# EAGLE schematic converting_to_smd (EAGLE 9.1.2)
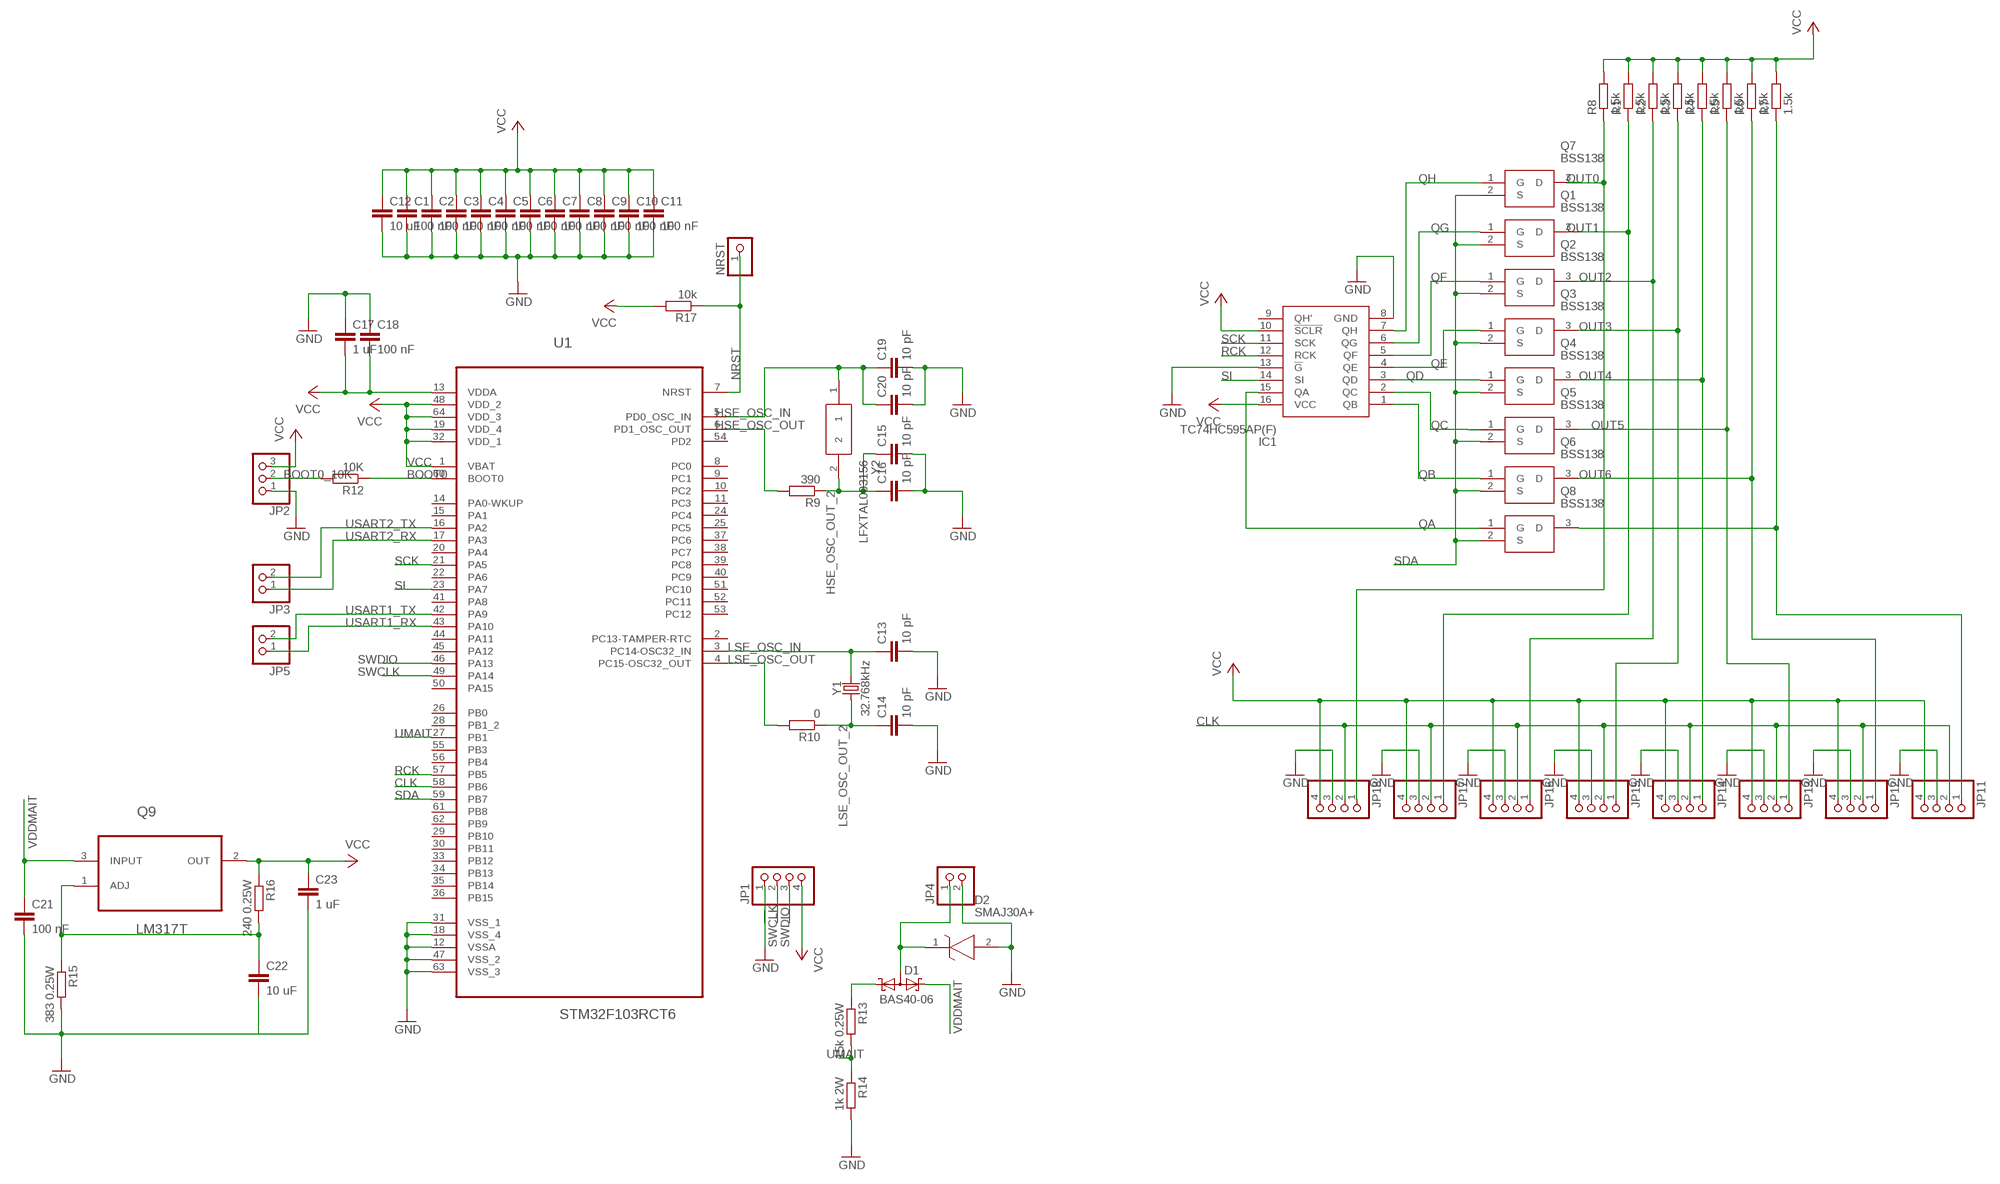
[diagram p0: schematic, sheet 1]

## Parts
C1  100 nF  C-EUC0603  [C0603]
C2  100 nF  C-EUC0603  [C0603]
C3  100 nF  C-EUC0603  [C0603]
C4  100 nF  C-EUC0603  [C0603]
C5  100 nF  C-EUC0603  [C0603]
C6  100 nF  C-EUC0603  [C0603]
C7  100 nF  C-EUC0603  [C0603]
C8  100 nF  C-EUC0603  [C0603]
C9  100 nF  C-EUC0603  [C0603]
C10  100 nF  C-EUC0603  [C0603]
C11  100 nF  C-EUC0603  [C0603]
C12  10 uF  C-EUC0603  [C0603]
C13  10 pF  C-EUC0805  [C0805]
C14  10 pF  C-EUC0805  [C0805]
C15  10 pF  C-EUC0805  [C0805]
C16  10 pF  C-EUC0805  [C0805]
C17  1 uF  C-EUC0603  [C0603]
C18  100 nF  C-EUC0603  [C0603]
C19  10 pF  C-EUC0805  [C0805]
C20  10 pF  C-EUC0805  [C0805]
C21  100 nF  C-EUC0603  [C0603]
C22  10 uF  C-EUC0603  [C0603]
C23  1 uF  C-EUC0603  [C0603]
D1  BAS40-06  [SOT23]
D2  SMAJ30A+  [DIOM5026X262N]
IC1  TC74HC595AP(F)  [DIP762W60P254L1925H445Q16N]
JP1  PINHD-1X4  [1X04]
JP2  PINHD-1X3  [1X03]
JP3  PINHD-1X2  [1X02]
JP4  PINHD-1X2  [1X02]
JP5  PINHD-1X2  [1X02]
JP11  PINHD-1X4  [1X04]
JP12  PINHD-1X4  [1X04]
JP13  PINHD-1X4  [1X04]
JP14  PINHD-1X4  [1X04]
JP15  PINHD-1X4  [1X04]
JP16  PINHD-1X4  [1X04]
JP17  PINHD-1X4  [1X04]
JP18  PINHD-1X4  [1X04]
NRST  PINHD-1X1  [1X01]
Q1  BSS138  [SOT95P240X120-3N]
Q2  BSS138  [SOT95P240X120-3N]
Q3  BSS138  [SOT95P240X120-3N]
Q4  BSS138  [SOT95P240X120-3N]
Q5  BSS138  [SOT95P240X120-3N]
Q6  BSS138  [SOT95P240X120-3N]
Q7  BSS138  [SOT95P240X120-3N]
Q8  BSS138  [SOT95P240X120-3N]
Q9  LM317T  [TO254P450X1020X2000-3P]
R1  1.5k  R-EU_0207/15  [0207/15]
R2  1.5k  R-EU_0207/15  [0207/15]
R3  1.5k  R-EU_0207/15  [0207/15]
R4  1.5k  R-EU_0207/15  [0207/15]
R5  1.5k  R-EU_0207/15  [0207/15]
R6  1.5k  R-EU_0207/15  [0207/15]
R7  1.5k  R-EU_0207/15  [0207/15]
R8  1.5k  R-EU_0207/15  [0207/15]
R9  390  R-EU_0207/15  [0207/15]
R10  0  R-EU_0207/15  [0207/15]
R12  10K  R-EU_0207/15  [0207/15]
R13  15k 0.25W  R-EU_0207/15  [0207/15]
R14  1k 2W  R-EU_0207/15  [0207/15]
R15  383 0.25W  R-EU_0207/15  [0207/15]
R16  240 0.25W  R-EU_0207/15  [0207/15]
R17  10k  R-EU_0207/15  [0207/15]
U1  STM32F103RCT6  [QFP50P1200X1200X160-64N]
Y1  32.768kHz  CRYSTAL-32.768KHZPTH-2X6  [CRYSTAL-PTH-2X6-CYL]
Y2  LFXTAL003156  [IQD-HC-49-4H]

## Nets
BOOT0: R12.1 U1.60(BOOT0)
BOOT0_10K: JP2.2 R12.2
CLK: JP11.2 JP12.2 JP13.2 JP14.2 JP15.2 JP16.2 JP17.2 JP18.2 U1.58(PB6)
GND: C1.2 C2.2 C3.2 C4.2 C5.2 C6.2 C7.2 C8.2 C9.2 C10.2 C11.2 C12.2 C13.2 C14.2 C15.2 C16.2 C17.1 C18.1 C19.2 C20.2 C21.2 C22.2 C23.2 D2.2(A) IC1.8(GND) IC1.13(!G) JP1.1 JP2.1 JP4.2 JP11.3 JP12.3 JP13.3 JP14.3 JP15.3 JP16.3 JP17.3 JP18.3 R14.2 R15.2 U1.12(VSSA) U1.18(VSS_4) U1.31(VSS_1) U1.47(VSS_2) U1.63(VSS_3)
HSE_OSC_IN: C19.1 C20.1 U1.5(PD0_OSC_IN) Y2.1
HSE_OSC_OUT: R9.2 U1.6(PD1_OSC_OUT)
HSE_OSC_OUT_2: C15.1 C16.1 R9.1 Y2.2
LSE_OSC_IN: C13.1 U1.3(PC14-OSC32_IN) Y1.2
LSE_OSC_OUT: R10.2 U1.4(PC15-OSC32_OUT)
LSE_OSC_OUT_2: C14.1 R10.1 Y1.1
N$1: D1.3(AA) D2.1(K) JP4.1
N$3: D1.1(K1) R13.1
N$4: C22.1 Q9.1(ADJ) R15.1 R16.2
NRST: NRST.1 R17.1 U1.7(NRST)
OUT0: JP18.1 Q7.3(D) R8.1
OUT1: JP17.1 Q1.3(D) R1.1
OUT2: JP16.1 Q2.3(D) R2.1
OUT3: JP15.1 Q3.3(D) R3.1
OUT4: JP14.1 Q4.3(D) R4.1
OUT5: JP13.1 Q5.3(D) R5.1
OUT6: JP12.1 Q6.3(D) R6.1
OUT7: JP11.1 Q8.3(D) R7.1
QA: IC1.15(QA) Q8.1(G)
QB: IC1.1(QB) Q6.1(G)
QC: IC1.2(QC) Q5.1(G)
QD: IC1.3(QD) Q4.1(G)
QE: IC1.4(QE) Q3.1(G)
QF: IC1.5(QF) Q2.1(G)
QG: IC1.6(QG) Q1.1(G)
QH: IC1.7(QH) Q7.1(G)
RCK: IC1.12(RCK) U1.57(PB5)
SCK: IC1.11(SCK) U1.21(PA5)
SDA: Q1.2(S) Q2.2(S) Q3.2(S) Q4.2(S) Q5.2(S) Q6.2(S) Q7.2(S) Q8.2(S) U1.59(PB7)
SI: IC1.14(SI) U1.23(PA7)
SWCLK: JP1.2 U1.49(PA14)
SWDIO: JP1.3 U1.46(PA13)
UMAIT: R13.2 R14.1 U1.27(PB1)
USART1_RX: JP5.1 U1.43(PA10)
USART1_TX: JP5.2 U1.42(PA9)
USART2_RX: JP3.1 U1.17(PA3)
USART2_TX: JP3.2 U1.16(PA2)
VCC: C1.1 C2.1 C3.1 C4.1 C5.1 C6.1 C7.1 C8.1 C9.1 C10.1 C11.1 C12.1 C17.2 C18.2 C23.1 IC1.10(!SCLR) IC1.16(VCC) JP1.4 JP2.3 JP11.4 JP12.4 JP13.4 JP14.4 JP15.4 JP16.4 JP17.4 JP18.4 Q9.2(OUT) R1.2 R2.2 R3.2 R4.2 R5.2 R6.2 R7.2 R8.2 R16.1 R17.2 U1.1(VBAT) U1.13(VDDA) U1.19(VDD_4) U1.32(VDD_1) U1.48(VDD_2) U1.64(VDD_3)
VDDMAIT: C21.1 D1.2(K2) Q9.3(INPUT)
Unconnected: IC1.9(QH') U1.2(PC13-TAMPER-RTC) U1.8(PC0) U1.9(PC1) U1.10(PC2) U1.11(PC3) U1.14(PA0-WKUP) U1.15(PA1) U1.20(PA4) U1.22(PA6) U1.24(PC4) U1.25(PC5) U1.26(PB0) U1.28(PB1_2) U1.29(PB10) U1.30(PB11) U1.33(PB12) U1.34(PB13) U1.35(PB14) U1.36(PB15) U1.37(PC6) U1.38(PC7) U1.39(PC8) U1.40(PC9) U1.41(PA8) U1.44(PA11) U1.45(PA12) U1.50(PA15) U1.51(PC10) U1.52(PC11) U1.53(PC12) U1.54(PD2) U1.55(PB3) U1.56(PB4) U1.61(PB8) U1.62(PB9)

## Library data of the parts
C1-C11 C17 C18 C21 C23 = rcl:C-EU: CAPACITOR, European symbol; SPICEPREFIX: C
C12-C16 C19 C20 C22 = resistor:C-EU: CAPACITOR, European symbol
D1 = diode:BAS40-06: Silicon Schottky Diodes General-purpose diode for high-speed switching
D2 = SMAJ30A+:SMAJ30A+: MULTICOMP - SMAJ30A+ - TVS DIODE, 400W, 30V, UNIDIR, DO-214AC Source: Datasheet <https://componentsearchengine.com/Datasheets/2/SMAJ30A .pdf>; DESCRIPTION: MULTICOMP - SMAJ30A+ - TVS DIODE, 400W, 30V, UNIDIR, DO-214AC; HEIGHT: 2.62mm; MANUFACTURER_NAME: MULTICOMP; MANUFACTURER_PART_NUMBER: SMAJ30A+
IC1 = TC74HC595AP(F):TC74HC595AP(F): IC,CMOS logic,DIP16,SHIFT REGISTERS Source: Datasheet <http://toshiba.semicon-storage.com/info/docget.jsp?did=16512&prodName=TC74HC595AP>; DESCRIPTION: IC,CMOS logic,DIP16,SHIFT REGISTERS; HEIGHT: 4.45mm; MANUFACTURER_NAME: Toshiba; MANUFACTURER_PART_NUMBER: TC74HC595AP(F); MOUSER_PART_NUMBER: N/A; MOUSER_PRICE-STOCK: https://www.mouser.com/Search/Refine.aspx?Keyword=N%2FA; RS_PART_NUMBER: 5400095P; RS_PRICE-STOCK: http://au.rs-online.com/web/p/products/5400095P
JP1 JP11-JP18 = pinhead:PINHD-1X4: PIN HEADER
JP2 = pinhead:PINHD-1X3: PIN HEADER
JP3-JP5 = pinhead:PINHD-1X2: PIN HEADER
NRST = pinhead:PINHD-1X1: PIN HEADER
Q1-Q8 = BSS138:BSS138: N-channel MOSFET,BSS138 0.2A 50V Source: Datasheet <https://www.onsemi.com/pub/Collateral/BSS138-D.PDF>; DESCRIPTION: N-channel MOSFET,BSS138 0.2A 50V; HEIGHT: 1.2mm; MANUFACTURER_NAME: ON Semiconductor; MANUFACTURER_PART_NUMBER: BSS138; MOUSER_PART_NUMBER: 512-BSS138; RS_PART_NUMBER: 1241694; RS_PRICE-STOCK: http://uk.rs-online.com/web/p/products/1241694
Q9 = LM317T:LM317T: 1.2 V to 37 V adjustable voltage regulators; AVAILABILITY: Unavailable; MF: Texas Instruments; MP: LM317T; PACKAGE: TO-220-3 HTC Korea; PRICE: None
R1-R10 R12-R17 = rcl:R-EU_: RESISTOR, European symbol; SPICEPREFIX: R
U1 = STM32F103RCT6:STM32F103RCT6: ARM-based 32-bit MCU; AVAILABILITY: Unavailable; DESCRIPTION: Mainstream Performance line, ARM Cortex-M3 MCU with 256 Kbytes Flash, 72 MHz CPU, motor control, USB and CAN; MF: STMicroelectronics; MP: STM32F103RCT6; PACKAGE: LQFP-64 STMicroelectronics; PRICE: None
Y1 = SparkFun-Clocks:CRYSTAL-32.768KHZ: 32.768kHz Crystal Frequency: 32.768kHz Frequency Stability: ±20ppm Load Capacitance: 12.5pF (PTH-2X6 & SMD-3.2X1.5), 6pF (SMD-2X6) SparkFun Products: SparkFun BigTime Watch Kit <https://www.sparkfun.com/products/11734> SparkFun nRF52832 Breakout <https://www.sparkfun.com/products/13990> SparkFun Real Time Clock Module <https://www.sparkfun.com/products/12708>; PROD_ID: XTAL-10112
Y2 = LFXTAL003156:LFXTAL003156: Crystal,8.0000MHz,30ppm,30pF,HC49/4H,XTAL003156 8MHZ Source: Datasheet <https://docs-emea.rs-online.com/webdocs/00af/0900766b800afdaf.pdf>; ALLIED_NUMBER: R1047051; ALLIED_PRICE-STOCK: https://www.alliedelec.com/iqd-frequency-products-lfxtal003156/R1047051/; DESCRIPTION: Crystal,8.0000MHz,30ppm,30pF,HC49/4H,XTAL003156 8MHZ; HEIGHT: mm; MANUFACTURER_NAME: IQD; MANUFACTURER_PART_NUMBER: LFXTAL003156; RS_PART_NUMBER: 1533666; RS_PRICE-STOCK: http://uk.rs-online.com/web/p/products/1533666

## Net classes
0 default: clearance 0.25 mm